# Altium schematic sheet SubBus7.SchDoc
size A
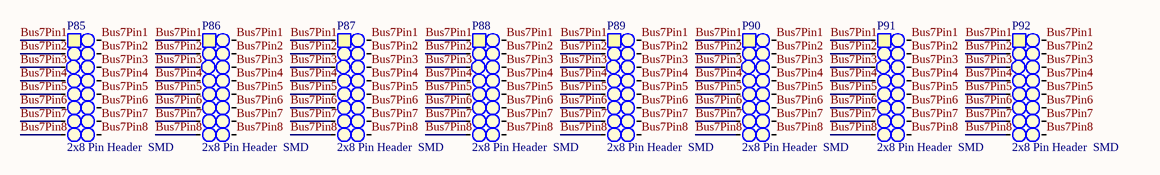
[diagram p0: SubBus7.SchDoc]

## Parts
P85  2x8 Pin Header  SMD  [2X8_SMD_PH_2.54]
P86  2x8 Pin Header  SMD  [2X8_SMD_PH_2.54]
P87  2x8 Pin Header  SMD  [2X8_SMD_PH_2.54]
P88  2x8 Pin Header  SMD  [2X8_SMD_PH_2.54]
P89  2x8 Pin Header  SMD  [2X8_SMD_PH_2.54]
P90  2x8 Pin Header  SMD  [2X8_SMD_PH_2.54]
P91  2x8 Pin Header  SMD  [2X8_SMD_PH_2.54]
P92  2x8 Pin Header  SMD  [2X8_SMD_PH_2.54]

## Nets
Bus7Pin1: P85.1 P85.16 P86.1 P86.16 P87.1 P87.16 P88.1 P88.16 P89.1 P89.16 P90.1 P90.16 P91.1 P91.16 P92.1 P92.16
Bus7Pin2: P85.2 P85.15 P86.2 P86.15 P87.2 P87.15 P88.2 P88.15 P89.2 P89.15 P90.2 P90.15 P91.2 P91.15 P92.2 P92.15
Bus7Pin3: P85.3 P85.14 P86.3 P86.14 P87.3 P87.14 P88.3 P88.14 P89.3 P89.14 P90.3 P90.14 P91.3 P91.14 P92.3 P92.14
Bus7Pin4: P85.4 P85.13 P86.4 P86.13 P87.4 P87.13 P88.4 P88.13 P89.4 P89.13 P90.4 P90.13 P91.4 P91.13 P92.4 P92.13
Bus7Pin5: P85.5 P85.12 P86.5 P86.12 P87.5 P87.12 P88.5 P88.12 P89.5 P89.12 P90.5 P90.12 P91.5 P91.12 P92.5 P92.12
Bus7Pin6: P85.6 P85.11 P86.6 P86.11 P87.6 P87.11 P88.6 P88.11 P89.6 P89.11 P90.6 P90.11 P91.6 P91.11 P92.6 P92.11
Bus7Pin7: P85.7 P85.10 P86.7 P86.10 P87.7 P87.10 P88.7 P88.10 P89.7 P89.10 P90.7 P90.10 P91.7 P91.10 P92.7 P92.10
Bus7Pin8: P85.8 P85.9 P86.8 P86.9 P87.8 P87.9 P88.8 P88.9 P89.8 P89.9 P90.8 P90.9 P91.8 P91.9 P92.8 P92.9

## Library data of the parts
P85-P92 = 2x8 Pin Header  SMD: 2.54mm, SMD; Value: 2x8 Pin Header, 2.54mm, SMD; Farnell: 2356242